# EAGLE design jlink_to_tag (EAGLE 6.5.0)
AUTHOR: Brad Campbell; REV: D; TITLE: JLink to Tag Connect x8

## Sheet 1 of 3
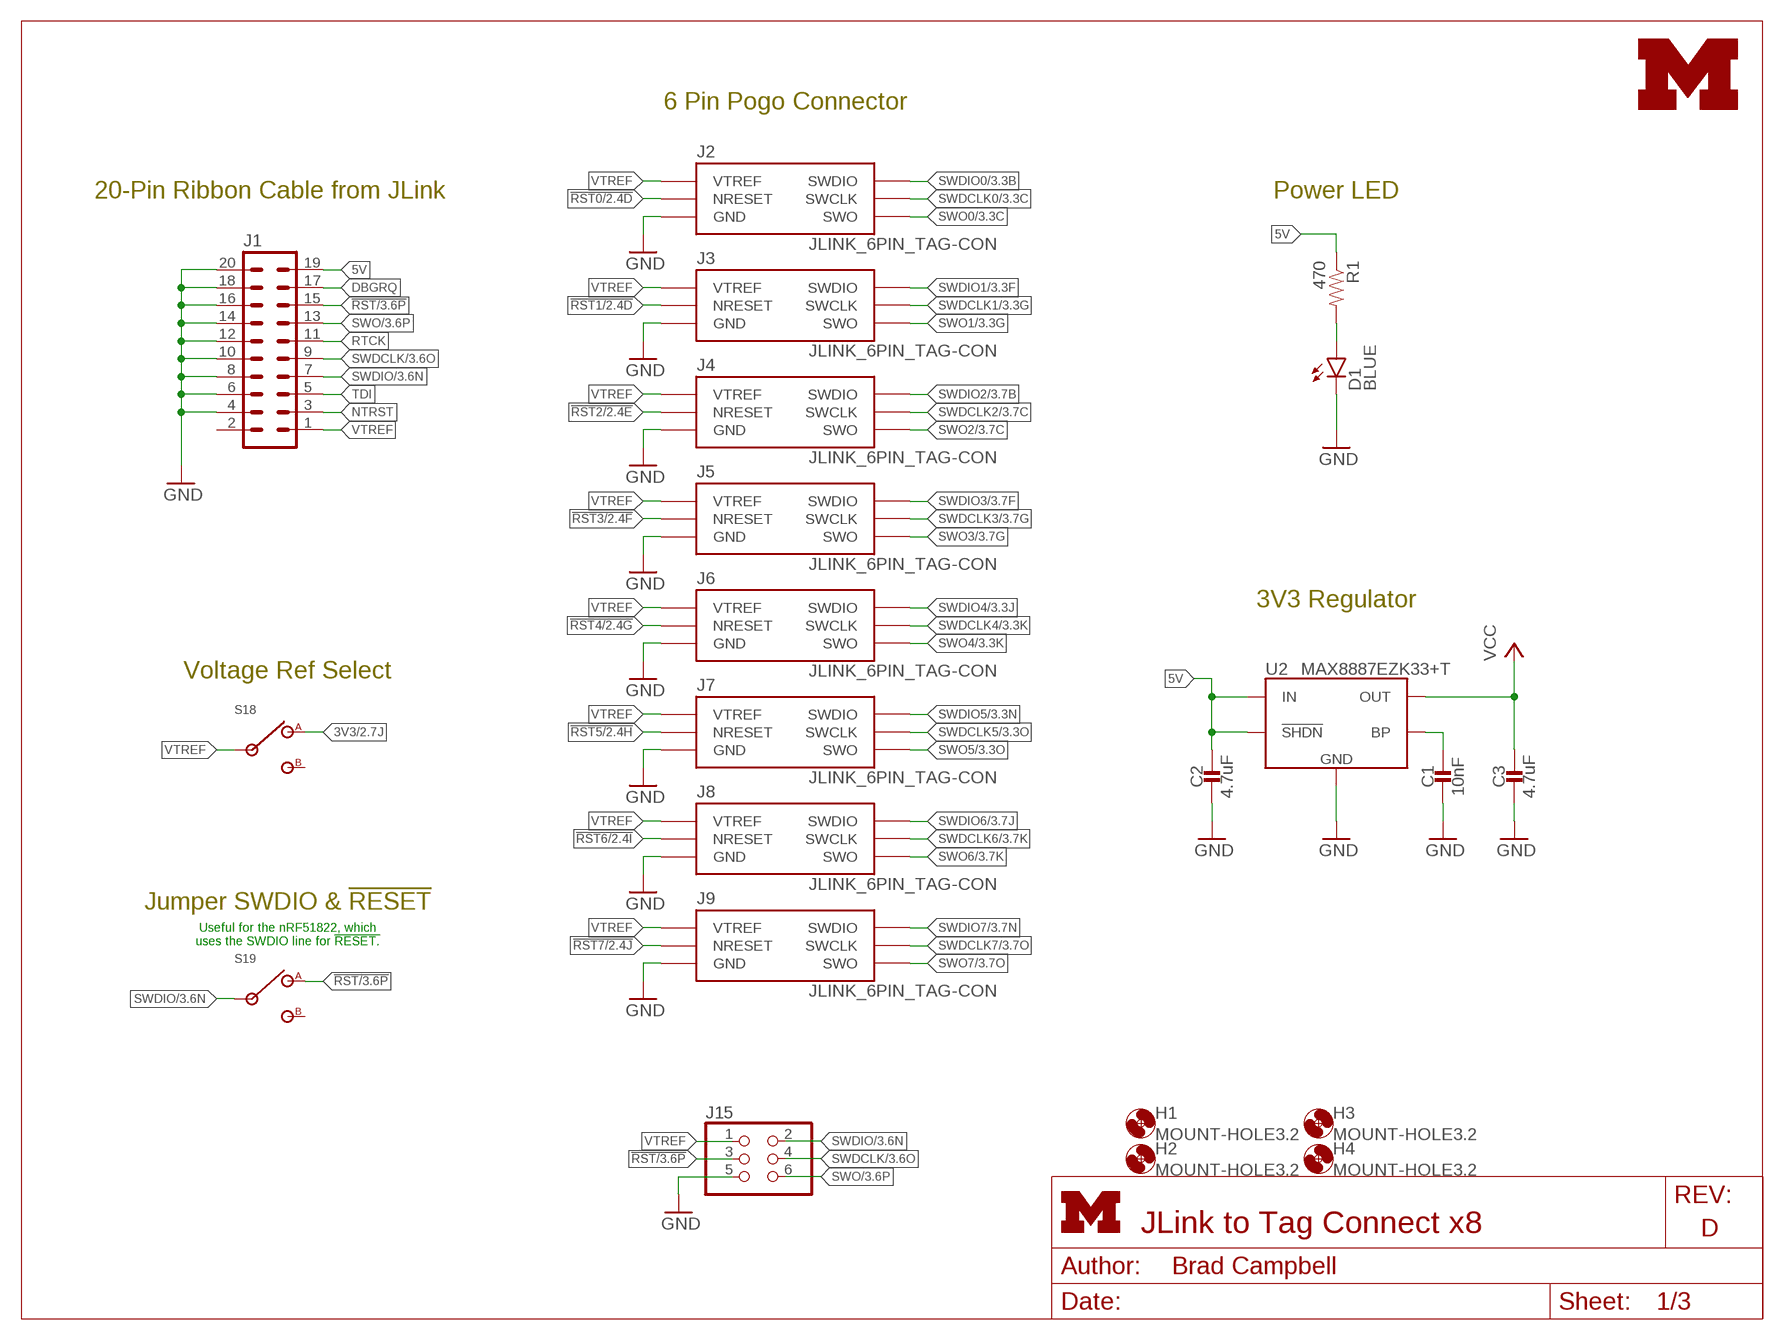
[diagram p0: schematic, sheet 1]
FRAME1 (LETTER_L): HEIGHT: 8.5in; WIDTH: 11in

### Parts
C1  10nF  CAPACITOR0603_CAP  [0603_CAP]
C2  4.7uF  CAPACITOR0603_CAP  [0603_CAP]
C3  4.7uF  CAPACITOR0603_CAP  [0603_CAP]
D1  BLUE  LED-BLUE0603  [LED-0603]
H1  MOUNT-HOLE3.2  [3,2]
H2  MOUNT-HOLE3.2  [3,2]
H3  MOUNT-HOLE3.2  [3,2]
H4  MOUNT-HOLE3.2  [3,2]
J1  ML20  [ML20]
J2  JLINK_6PIN_TAG-CON  [2X3_MALE_SHROUDED_0.100]
J3  JLINK_6PIN_TAG-CON  [2X3_MALE_SHROUDED_0.100]
J4  JLINK_6PIN_TAG-CON  [2X3_MALE_SHROUDED_0.100]
J5  JLINK_6PIN_TAG-CON  [2X3_MALE_SHROUDED_0.100]
J6  JLINK_6PIN_TAG-CON  [2X3_MALE_SHROUDED_0.100]
J7  JLINK_6PIN_TAG-CON  [2X3_MALE_SHROUDED_0.100]
J8  JLINK_6PIN_TAG-CON  [2X3_MALE_SHROUDED_0.100]
J9  JLINK_6PIN_TAG-CON  [2X3_MALE_SHROUDED_0.100]
J15  PINHD-2X3  [2X03]
LOGO1  UMICH_SOLID_SMALL+  [UMICH_SOLID_100MIL]
R1  470  RESISTOR0603-RES  [0603-RES]
S18  STS121PC04  [STS121PC04]
S19  STS121PC04  [STS121PC04]
U2  MAX8887EZK33+T  [SOT-23-5]

### Nets
3V3: C3.1 S18.1 U2.5(OUT) ; supply symbol labelled VCC ; also sheet 2,3
5V: C2.1 J1.19 R1.1 U2.1(IN) U2.3(!SHDN)
!RST: J1.15 J15.3 S19.1 ; also sheet 3
!RST0: J2.3(NRESET) ; also sheet 2,3
!RST1: J3.3(NRESET) ; also sheet 2,3
!RST2: J4.3(NRESET) ; also sheet 2,3
!RST3: J5.3(NRESET) ; also sheet 2,3
!RST4: J6.3(NRESET) ; also sheet 2,3
!RST5: J7.3(NRESET) ; also sheet 2,3
!RST6: J8.3(NRESET) ; also sheet 2,3
!RST7: J9.3(NRESET) ; also sheet 2,3
DBGRQ: J1.17
GND: C1.2 C2.2 C3.2 D1.C J1.4 J1.6 J1.8 J1.10 J1.12 J1.14 J1.16 J1.18 J1.20 J2.5(GND) J3.5(GND) J4.5(GND) J5.5(GND) J6.5(GND) J7.5(GND) J8.5(GND) J9.5(GND) J15.5 U2.2(GND) ; also sheet 2,3
N$1: C1.1 U2.4(BP)
N$3: D1.A R1.2
NTRST: J1.3
RTCK: J1.11
SWDCLK: J1.9 J15.4 ; also sheet 3
SWDCLK0: J2.4(SWCLK) ; also sheet 3
SWDCLK1: J3.4(SWCLK) ; also sheet 3
SWDCLK2: J4.4(SWCLK) ; also sheet 3
SWDCLK3: J5.4(SWCLK) ; also sheet 3
SWDCLK4: J6.4(SWCLK) ; also sheet 3
SWDCLK5: J7.4(SWCLK) ; also sheet 3
SWDCLK6: J8.4(SWCLK) ; also sheet 3
SWDCLK7: J9.4(SWCLK) ; also sheet 3
SWDIO: J1.7 J15.2 S19.2 ; also sheet 3
SWDIO0: J2.2(SWDIO) ; also sheet 3
SWDIO1: J3.2(SWDIO) ; also sheet 3
SWDIO2: J4.2(SWDIO) ; also sheet 3
SWDIO3: J5.2(SWDIO) ; also sheet 3
SWDIO4: J6.2(SWDIO) ; also sheet 3
SWDIO5: J7.2(SWDIO) ; also sheet 3
SWDIO6: J8.2(SWDIO) ; also sheet 3
SWDIO7: J9.2(SWDIO) ; also sheet 3
SWO: J1.13 J15.6 ; also sheet 3
SWO0: J2.6(SWO) ; also sheet 3
SWO1: J3.6(SWO) ; also sheet 3
SWO2: J4.6(SWO) ; also sheet 3
SWO3: J5.6(SWO) ; also sheet 3
SWO4: J6.6(SWO) ; also sheet 3
SWO5: J7.6(SWO) ; also sheet 3
SWO6: J8.6(SWO) ; also sheet 3
SWO7: J9.6(SWO) ; also sheet 3
TDI: J1.5
VTREF: J1.1 J2.1(VTREF) J3.1(VTREF) J4.1(VTREF) J5.1(VTREF) J6.1(VTREF) J7.1(VTREF) J8.1(VTREF) J9.1(VTREF) J15.1 S18.2
Unconnected: J1.2 S18.3 S19.3

### Notes on the sheet
- 6 Pin Pogo Connector
- 20-Pin Ribbon Cable from JLink | Power LED
- 3V3 Regulator
- Voltage Ref Select
- Jumper SWDIO & !RESET
- Useful for the nRF51822, which
  uses the SWDIO line for !RESET.

## Sheet 2 of 3
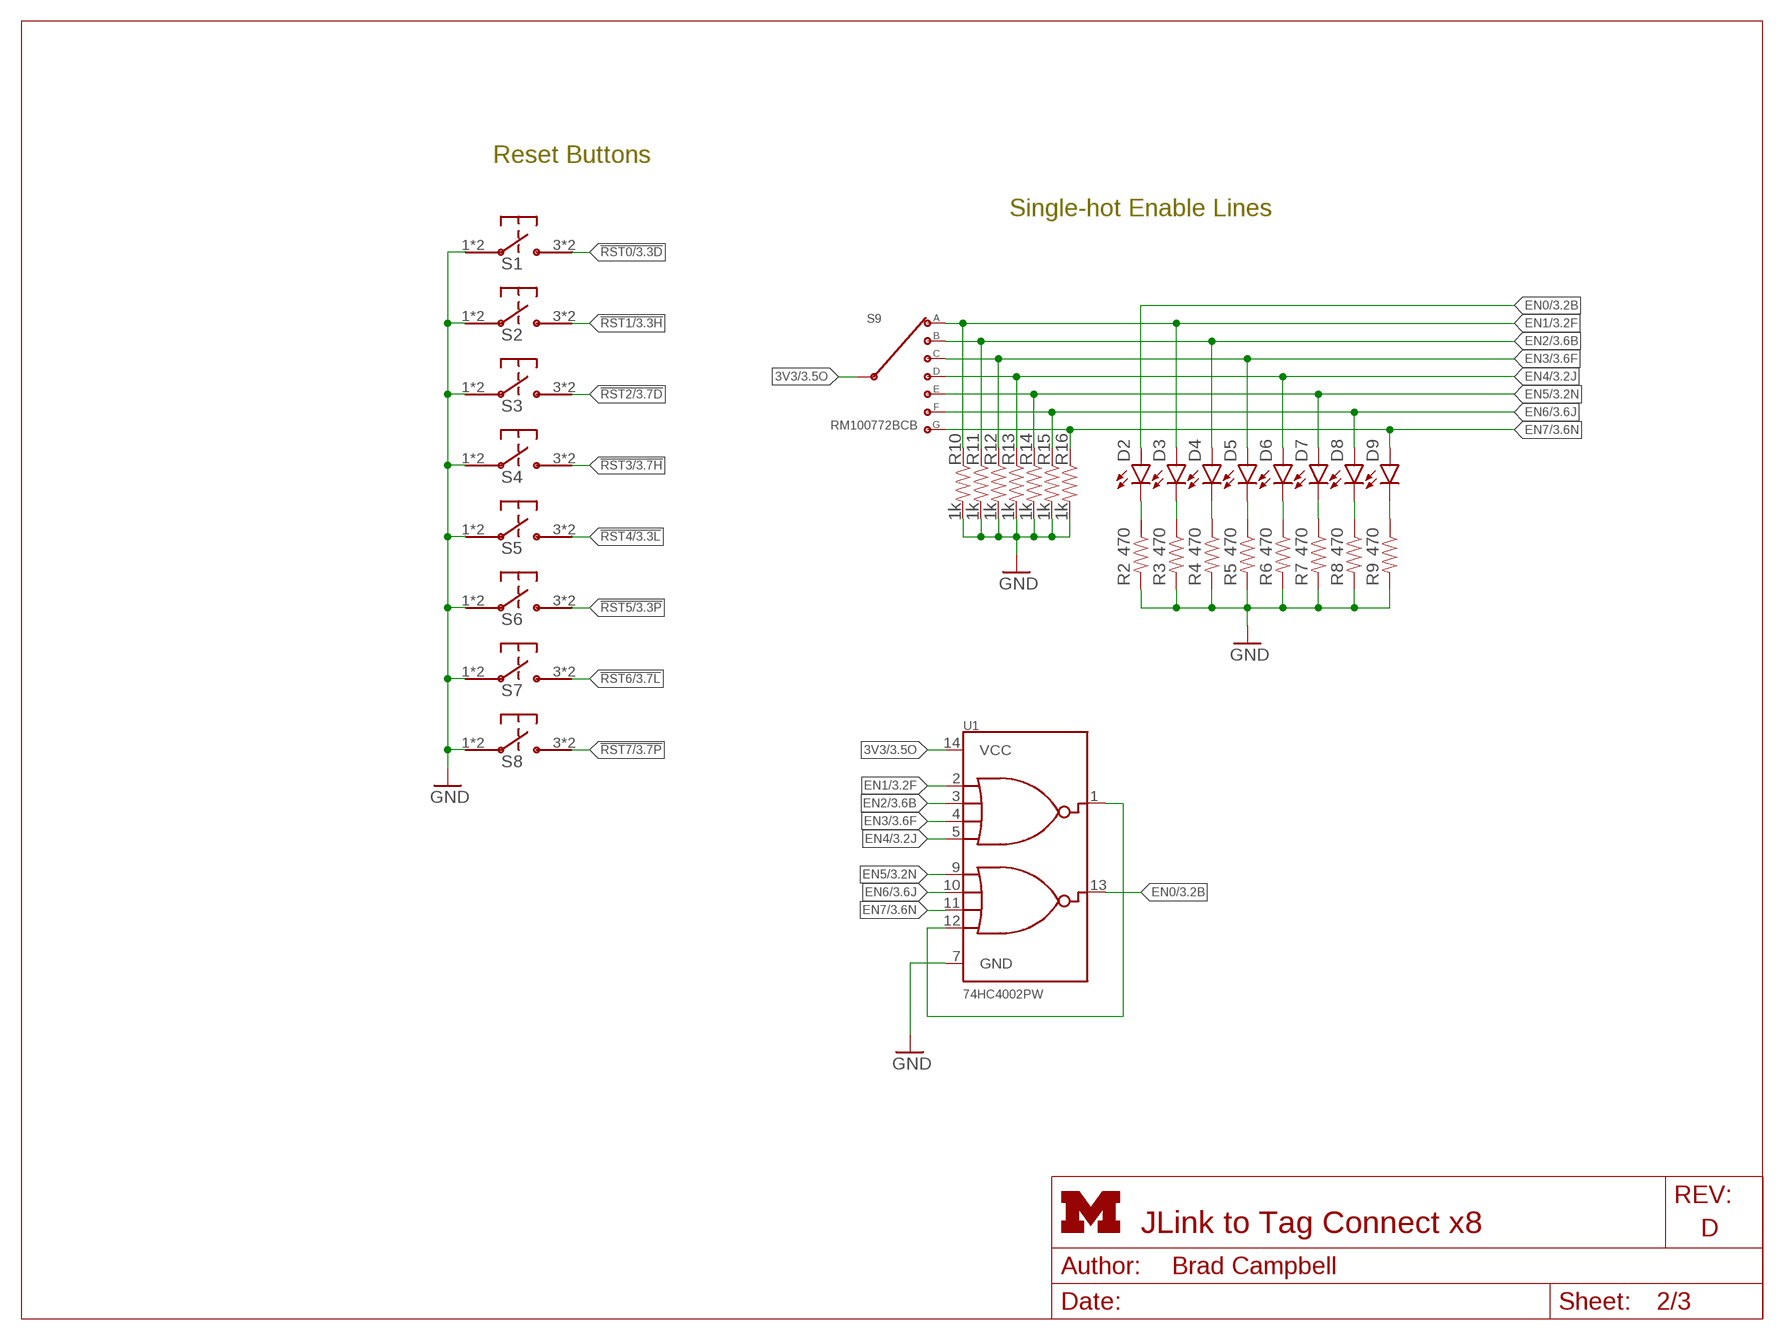
[diagram p1: schematic, sheet 2]
FRAME2 (LETTER_L): HEIGHT: 8.5in; WIDTH: 11in

### Parts
D2  BLUE  LED-BLUE0603  [LED-0603]
D3  BLUE  LED-BLUE0603  [LED-0603]
D4  BLUE  LED-BLUE0603  [LED-0603]
D5  BLUE  LED-BLUE0603  [LED-0603]
D6  BLUE  LED-BLUE0603  [LED-0603]
D7  BLUE  LED-BLUE0603  [LED-0603]
D8  BLUE  LED-BLUE0603  [LED-0603]
D9  BLUE  LED-BLUE0603  [LED-0603]
R2  470  RESISTOR0603-RES  [0603-RES]
R3  470  RESISTOR0603-RES  [0603-RES]
R4  470  RESISTOR0603-RES  [0603-RES]
R5  470  RESISTOR0603-RES  [0603-RES]
R6  470  RESISTOR0603-RES  [0603-RES]
R7  470  RESISTOR0603-RES  [0603-RES]
R8  470  RESISTOR0603-RES  [0603-RES]
R9  470  RESISTOR0603-RES  [0603-RES]
R10  1k  RESISTOR0603-RES  [0603-RES]
R11  1k  RESISTOR0603-RES  [0603-RES]
R12  1k  RESISTOR0603-RES  [0603-RES]
R13  1k  RESISTOR0603-RES  [0603-RES]
R14  1k  RESISTOR0603-RES  [0603-RES]
R15  1k  RESISTOR0603-RES  [0603-RES]
R16  1k  RESISTOR0603-RES  [0603-RES]
S1  PTS645SM43SMTR92  [PTS645]
S2  PTS645SM43SMTR92  [PTS645]
S3  PTS645SM43SMTR92  [PTS645]
S4  PTS645SM43SMTR92  [PTS645]
S5  PTS645SM43SMTR92  [PTS645]
S6  PTS645SM43SMTR92  [PTS645]
S7  PTS645SM43SMTR92  [PTS645]
S8  PTS645SM43SMTR92  [PTS645]
S9  RM100772BCB  [RM-SWITCH]
U1  74HC4002PW  [TSSOP-14/5MM]

### Nets
3V3: S9.C(INPUT) U1.14(VCC) ; also sheet 1,3
!RST0: S1.3 S1.4 ; also sheet 1,3
!RST1: S2.3 S2.4 ; also sheet 1,3
!RST2: S3.3 S3.4 ; also sheet 1,3
!RST3: S4.3 S4.4 ; also sheet 1,3
!RST4: S5.3 S5.4 ; also sheet 1,3
!RST5: S6.3 S6.4 ; also sheet 1,3
!RST6: S7.3 S7.4 ; also sheet 1,3
!RST7: S8.3 S8.4 ; also sheet 1,3
EN0: D2.A U1.13(BOUT) ; also sheet 3
EN1: D3.A R10.1 S9.1(A) U1.2(A1) ; also sheet 3
EN2: D4.A R11.1 S9.2(B) U1.3(A2) ; also sheet 3
EN3: D5.A R12.1 S9.3(C) U1.4(A3) ; also sheet 3
EN4: D6.A R13.1 S9.4(D) U1.5(A4) ; also sheet 3
EN5: D7.A R14.1 S9.5(E) U1.9(B1) ; also sheet 3
EN6: D8.A R15.1 S9.6(F) U1.10(B2) ; also sheet 3
EN7: D9.A R16.1 S9.7(G) U1.11(B3) ; also sheet 3
GND: R2.2 R3.2 R4.2 R5.2 R6.2 R7.2 R8.2 R9.2 R10.2 R11.2 R12.2 R13.2 R14.2 R15.2 R16.2 S1.1 S1.2 S2.1 S2.2 S3.1 S3.2 S4.1 S4.2 S5.1 S5.2 S6.1 S6.2 S7.1 S7.2 S8.1 S8.2 U1.7(GND) ; also sheet 1,3
N$2: D2.C R2.1
N$5: D3.C R3.1
N$6: D4.C R4.1
N$7: D5.C R5.1
N$8: D6.C R6.1
N$9: D7.C R7.1
N$10: D8.C R8.1
N$11: D9.C R9.1
N$15: U1.1(AOUT) U1.12(B4)

### Notes on the sheet
- Reset Buttons
- Single-hot Enable Lines

## Sheet 3 of 3
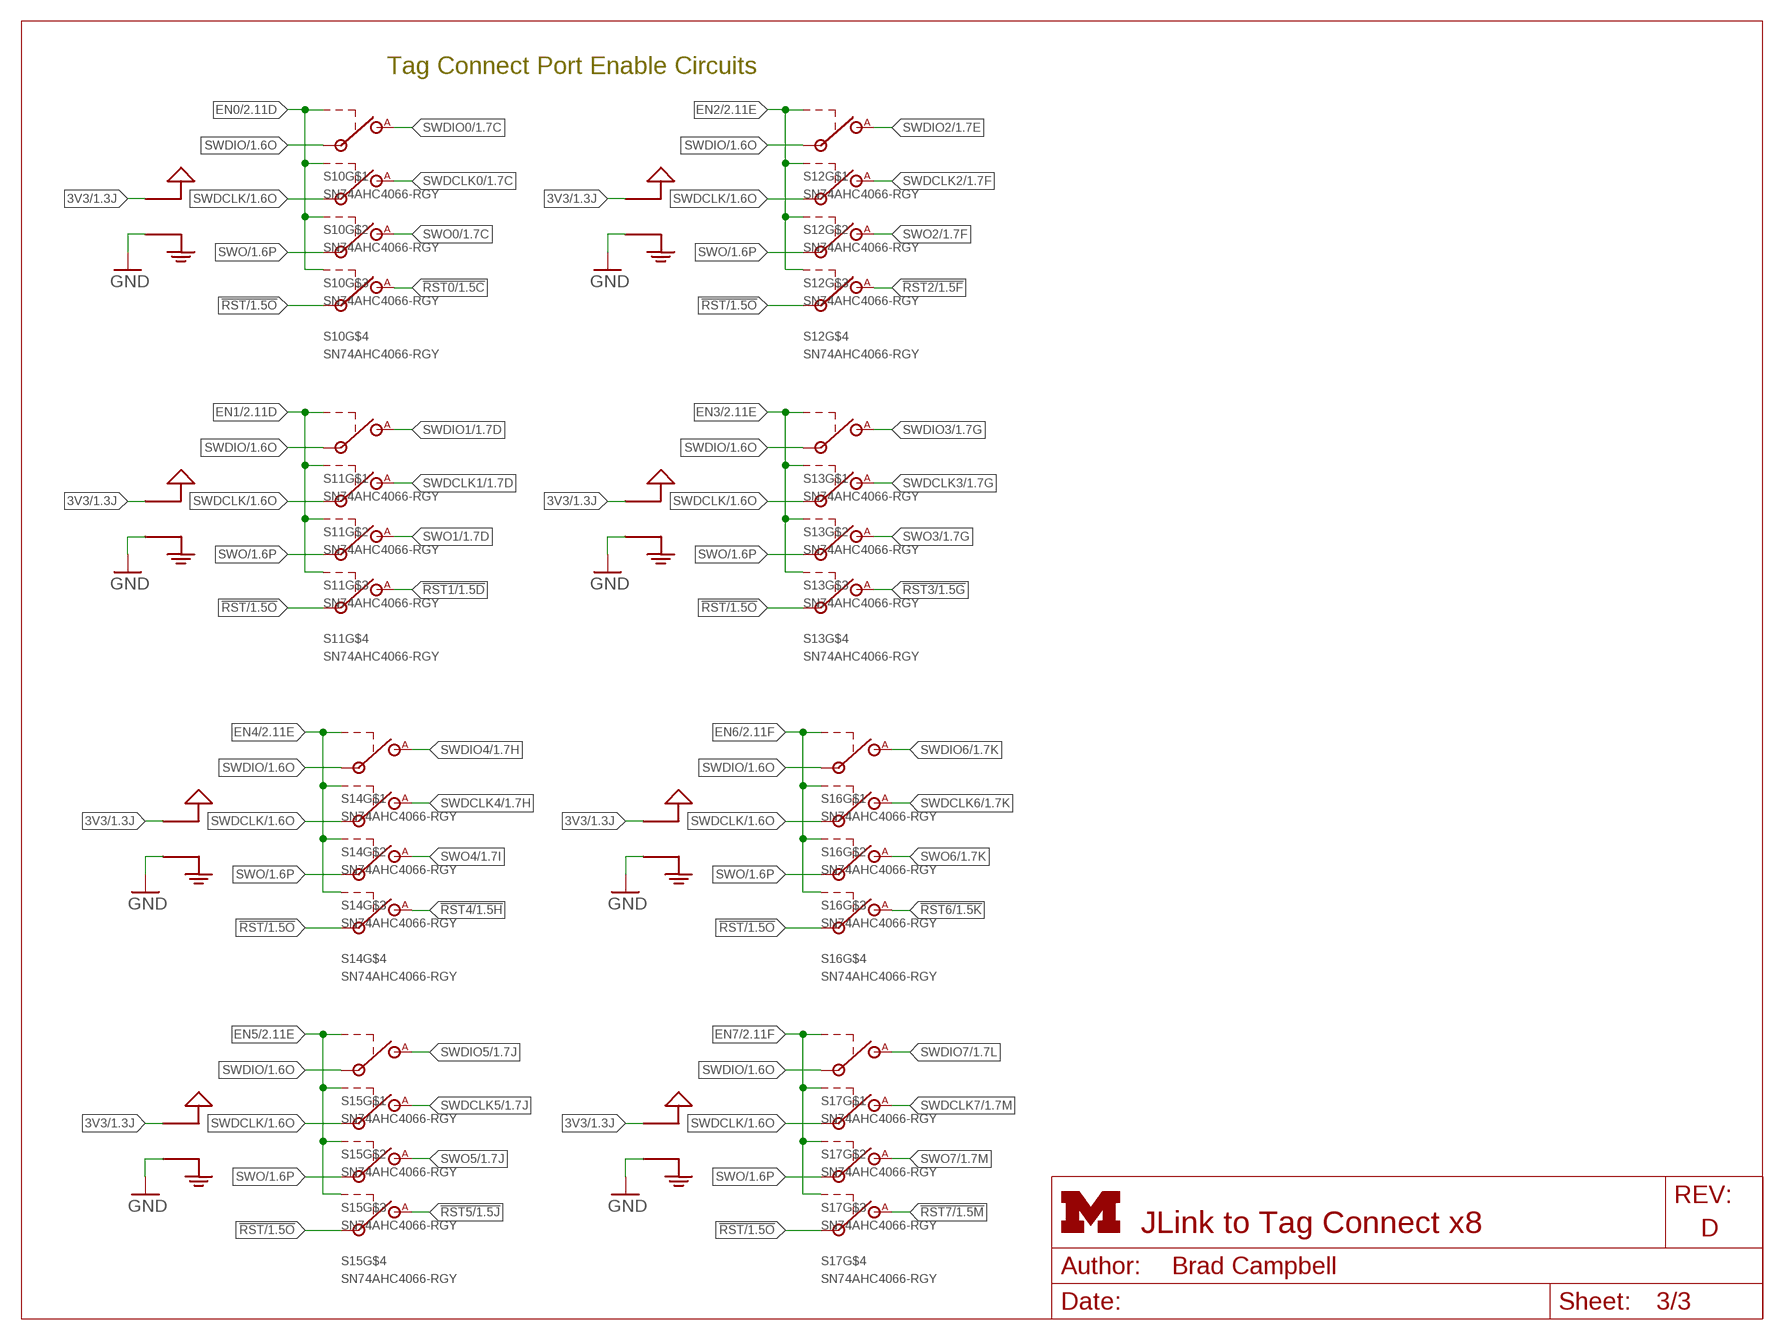
[diagram p2: schematic, sheet 3]
FRAME3 (LETTER_L): HEIGHT: 8.5in; WIDTH: 11in

### Parts
S10  SN74AHC4066-RGY  [S-PVQFN-N14-3.5MM]
S11  SN74AHC4066-RGY  [S-PVQFN-N14-3.5MM]
S12  SN74AHC4066-RGY  [S-PVQFN-N14-3.5MM]
S13  SN74AHC4066-RGY  [S-PVQFN-N14-3.5MM]
S14  SN74AHC4066-RGY  [S-PVQFN-N14-3.5MM]
S15  SN74AHC4066-RGY  [S-PVQFN-N14-3.5MM]
S16  SN74AHC4066-RGY  [S-PVQFN-N14-3.5MM]
S17  SN74AHC4066-RGY  [S-PVQFN-N14-3.5MM]

### Nets
3V3: S10.14(VCC) S11.14(VCC) S12.14(VCC) S13.14(VCC) S14.14(VCC) S15.14(VCC) S16.14(VCC) S17.14(VCC) ; also sheet 1,2
!RST: S10.11(IN) S11.11(IN) S12.11(IN) S13.11(IN) S14.11(IN) S15.11(IN) S16.11(IN) S17.11(IN) ; also sheet 1
!RST0: S10.10(A) ; also sheet 1,2
!RST1: S11.10(A) ; also sheet 1,2
!RST2: S12.10(A) ; also sheet 1,2
!RST3: S13.10(A) ; also sheet 1,2
!RST4: S14.10(A) ; also sheet 1,2
!RST5: S15.10(A) ; also sheet 1,2
!RST6: S16.10(A) ; also sheet 1,2
!RST7: S17.10(A) ; also sheet 1,2
EN0: S10.5(CTRL) S10.6(CTRL) S10.12(CTRL) S10.13(CTRL) ; also sheet 2
EN1: S11.5(CTRL) S11.6(CTRL) S11.12(CTRL) S11.13(CTRL) ; also sheet 2
EN2: S12.5(CTRL) S12.6(CTRL) S12.12(CTRL) S12.13(CTRL) ; also sheet 2
EN3: S13.5(CTRL) S13.6(CTRL) S13.12(CTRL) S13.13(CTRL) ; also sheet 2
EN4: S14.5(CTRL) S14.6(CTRL) S14.12(CTRL) S14.13(CTRL) ; also sheet 2
EN5: S15.5(CTRL) S15.6(CTRL) S15.12(CTRL) S15.13(CTRL) ; also sheet 2
EN6: S16.5(CTRL) S16.6(CTRL) S16.12(CTRL) S16.13(CTRL) ; also sheet 2
EN7: S17.5(CTRL) S17.6(CTRL) S17.12(CTRL) S17.13(CTRL) ; also sheet 2
GND: S10.7(GND) S11.7(GND) S12.7(GND) S13.7(GND) S14.7(GND) S15.7(GND) S16.7(GND) S17.7(GND) ; also sheet 1,2
SWDCLK: S10.4(IN) S11.4(IN) S12.4(IN) S13.4(IN) S14.4(IN) S15.4(IN) S16.4(IN) S17.4(IN) ; also sheet 1
SWDCLK0: S10.3(A) ; also sheet 1
SWDCLK1: S11.3(A) ; also sheet 1
SWDCLK2: S12.3(A) ; also sheet 1
SWDCLK3: S13.3(A) ; also sheet 1
SWDCLK4: S14.3(A) ; also sheet 1
SWDCLK5: S15.3(A) ; also sheet 1
SWDCLK6: S16.3(A) ; also sheet 1
SWDCLK7: S17.3(A) ; also sheet 1
SWDIO: S10.1(IN) S11.1(IN) S12.1(IN) S13.1(IN) S14.1(IN) S15.1(IN) S16.1(IN) S17.1(IN) ; also sheet 1
SWDIO0: S10.2(A) ; also sheet 1
SWDIO1: S11.2(A) ; also sheet 1
SWDIO2: S12.2(A) ; also sheet 1
SWDIO3: S13.2(A) ; also sheet 1
SWDIO4: S14.2(A) ; also sheet 1
SWDIO5: S15.2(A) ; also sheet 1
SWDIO6: S16.2(A) ; also sheet 1
SWDIO7: S17.2(A) ; also sheet 1
SWO: S10.8(IN) S11.8(IN) S12.8(IN) S13.8(IN) S14.8(IN) S15.8(IN) S16.8(IN) S17.8(IN) ; also sheet 1
SWO0: S10.9(A) ; also sheet 1
SWO1: S11.9(A) ; also sheet 1
SWO2: S12.9(A) ; also sheet 1
SWO3: S13.9(A) ; also sheet 1
SWO4: S14.9(A) ; also sheet 1
SWO5: S15.9(A) ; also sheet 1
SWO6: S16.9(A) ; also sheet 1
SWO7: S17.9(A) ; also sheet 1

### Notes on the sheet
- Tag Connect Port Enable Circuits

## Library data of the parts
C1 = passives:CAPACITOR: 0402 Capacitor; DIGIKEY: 490-1512-1-ND
C2 C3 = passives:CAPACITOR: 0402 Capacitor; DIGIKEY: 490-3297-1-ND
D1-D9 = SparkFun-LED:LED-BLUE: Blue LEDs for production use Various blue LEDs stocked by SparkFun production 0603 - DIO-08575 Rebel - DIO-09553 1206 - DIO-09911; PROD_ID: DIO-08575
H1-H4 = holes:MOUNT-HOLE: MOUNTING HOLE with drill center marker
J1 = con-ml:ML20: HARTING; DIGIKEY: S9172-ND; OC_FARNELL: unknown; OC_NEWARK: unknown
J2-J9 = headers:JLINK_6PIN_TAG-CON: This is a 6-pin Tag Connect header with the J-Link.; DIGIKEY: 3M15451-ND
J15 = pinhead:PINHD-2X3: PIN HEADER
LOGO1 = logos:UMICH_SOLID
R1-R16 = SparkFun-Passives:RESISTOR: Resistor Basic schematic elements and footprints for 0603, 1206, and PTH resistors.
S1-S8 = switches:PTS645SM43SMTR92: Tactile Switch SPST-NO Top Actuated Surface Mount; DIGIKEY: CKN9112CT-ND
S9 = switches:RM100772BCB: Rotary Switch 8 Position SP7T 500mA (DC) 24VDC Through Hole
S10-S17 = switches:SN74AHC4066; DIGIKEY: 296-15258-1-ND
S18 S19 = switches:STS121PC04: Slide Switch SPDT Through Hole; DIGIKEY: 450-1609-ND
U1 = chips:74HC4002PW: NOR Gate IC 2 Channel 14-TSSOP; DIGIKEY: 568-8879-1-ND
U2 = chips:MAX8887: IC REG LDO 3.3V 0.3A TSOT23-5; DIGIKEY: MAX8887EZK33+TCT-ND

## Board
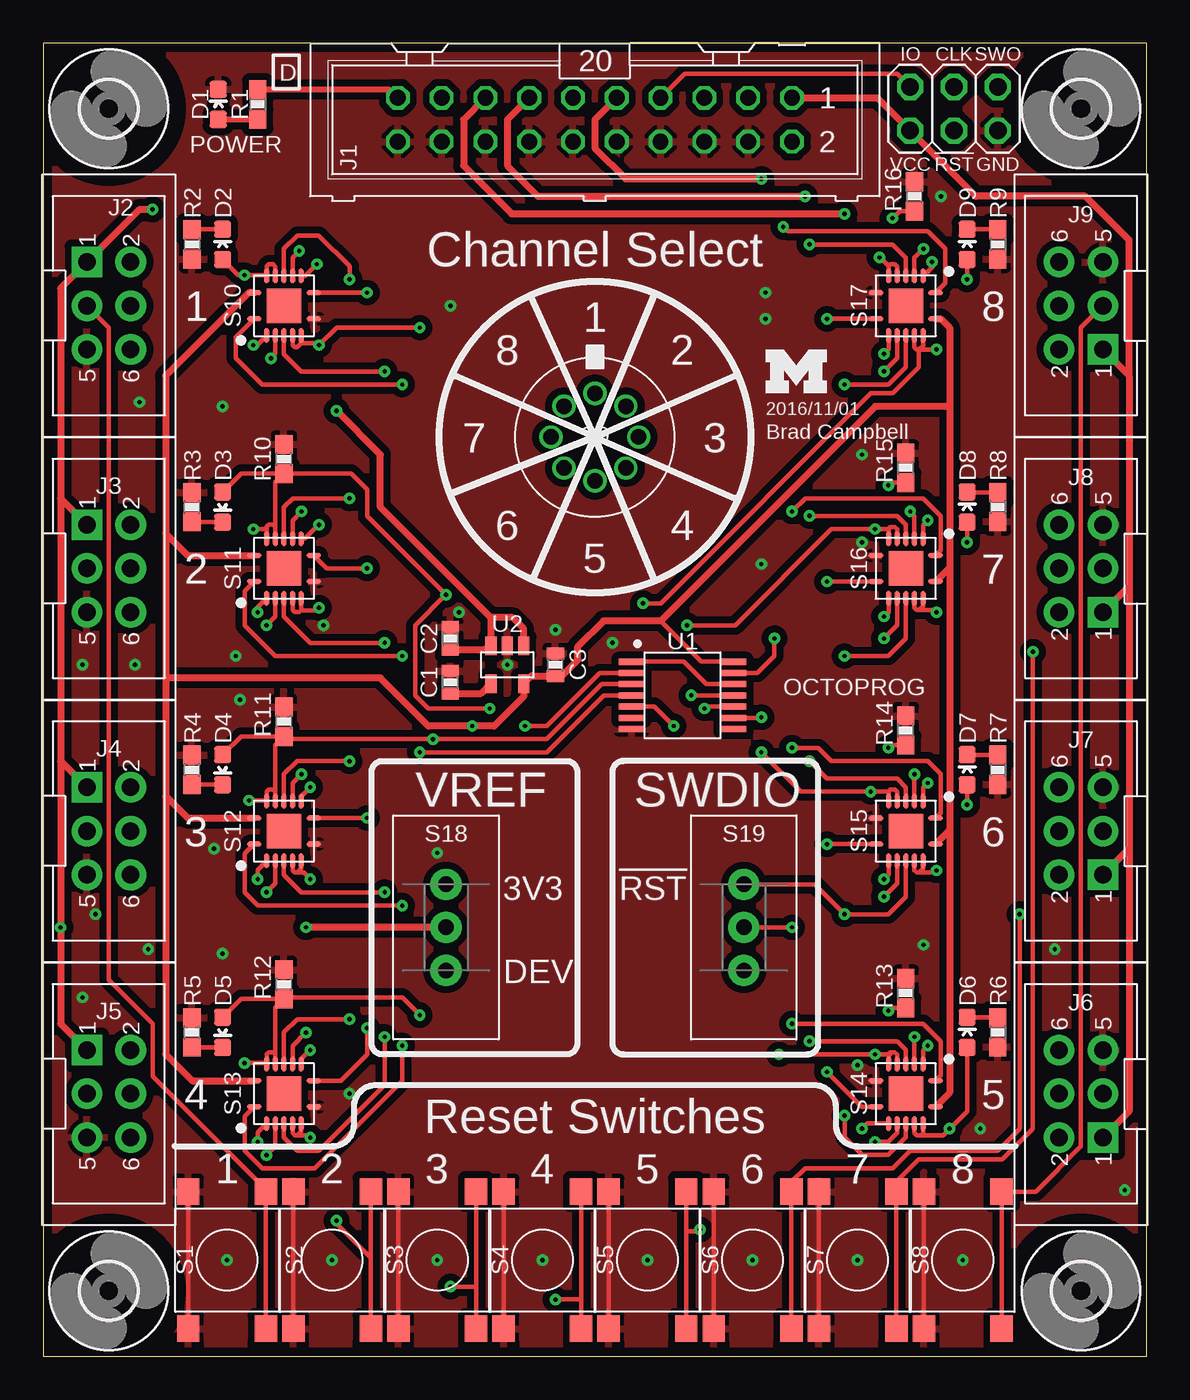
[diagram p3: board, top side]
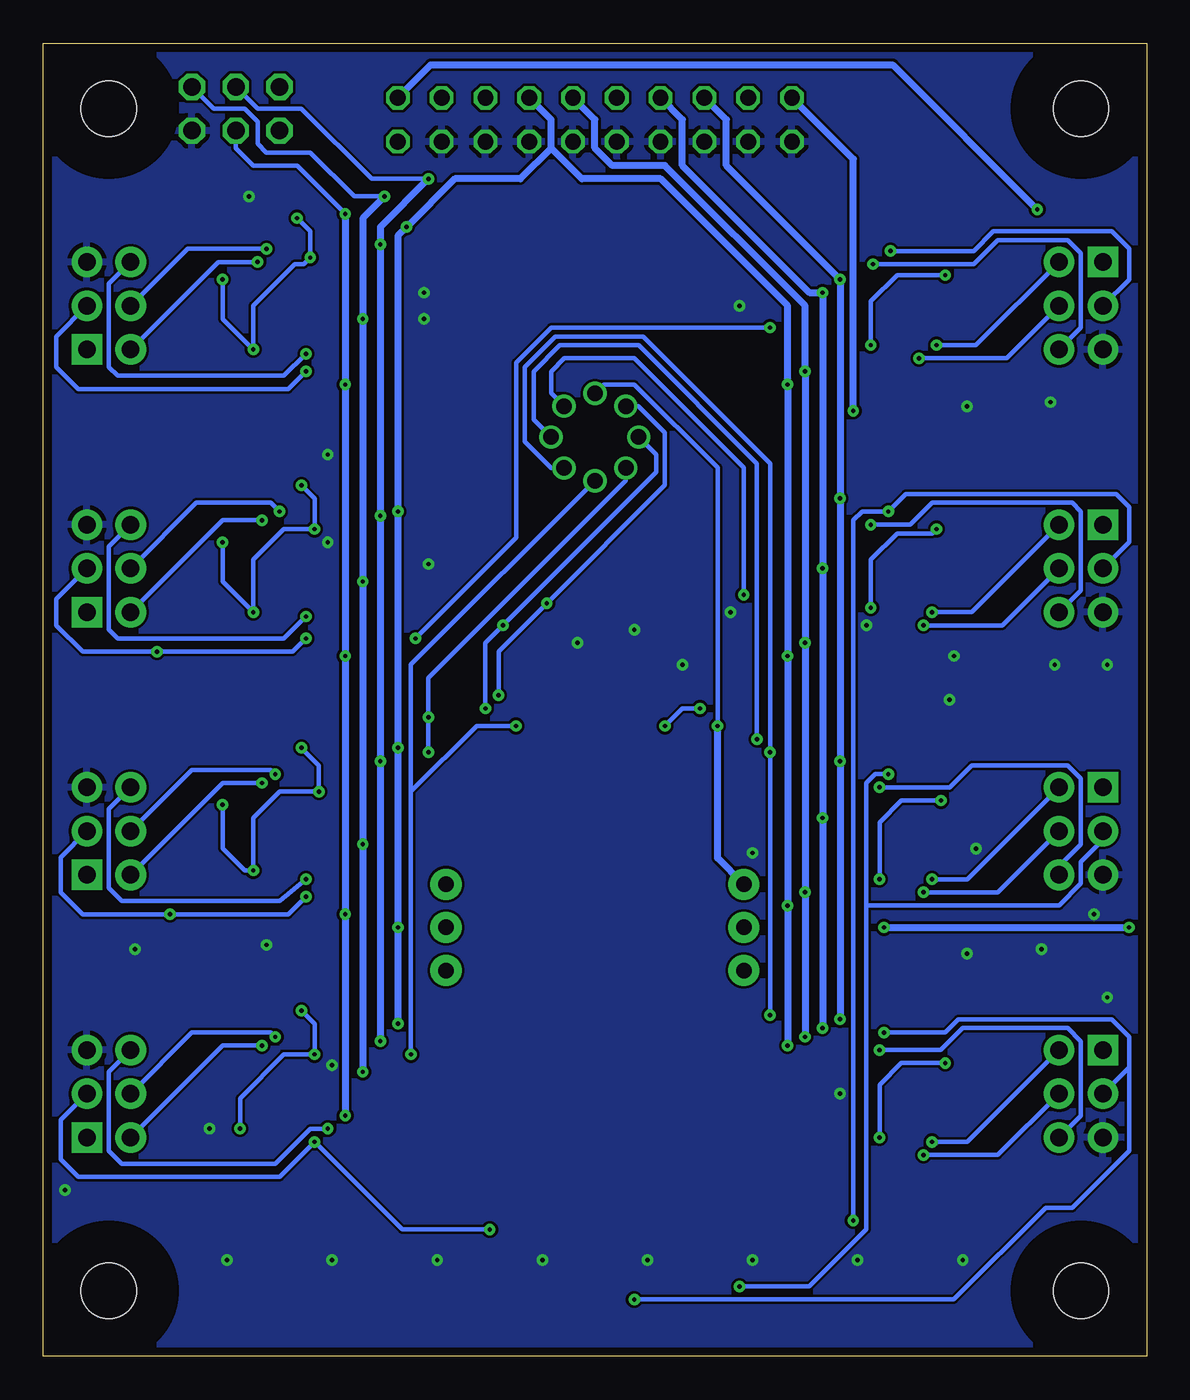
[diagram p4: board, bottom side, seen from below]

Size 64.01 x 76.2 mm. Coordinates in mm from the lower left corner, seen from the top.
Outline: 0,76.2 0,0 64.01,0 64.01,76.2 0,76.2
Copper layers (1*16): Top 0.0178mm / dielectric 59mil / Bottom 0.0178mm
Design rules "sunstone-2lyr_v1.0.0.3 *": minimum track width 6mil, minimum drill 8mil, track to track 6mil, track to pad 6mil, pad to pad 6mil, via to via 6mil, smd to smd 6mil, copper to edge 20mil, drill to drill 16mil, minimum pad ring 8mil, minimum via ring 8mil, stop-mask expansion 3mil, vias tented up to drill 50mil, thermal gap 10mil

### Footprints (pad centres in the part's own frame; a part is rotated, then mirrored left to right if it is on the bottom)
0603_CAP = smd 0.7 x 1: 1 -0.65,0; 2 0.65,0
LED-0603 = smd 1 x 1: A 0,-0.877; C 0,0.877
3,2 = hole 3.2: 0,0
ML20 = drill 0.914 octagon: 1 -11.43,-1.27; 2 -11.43,1.27; 3 -8.89,-1.27; 4 -8.89,1.27; 5 -6.35,-1.27; 6 -6.35,1.27; 7 -3.81,-1.27; 8 -3.81,1.27; 9 -1.27,-1.27; 10 -1.27,1.27; 11 1.27,-1.27; 12 1.27,1.27; 13 3.81,-1.27; 14 3.81,1.27; 15 6.35,-1.27; 16 6.35,1.27; 17 8.89,-1.27; 18 8.89,1.27; 19 11.43,-1.27; 20 11.43,1.27
2X3_MALE_SHROUDED_0.100 = drill 1.016 pad 1.778 square: 1 -2.54,-1.27 | drill 1.016 pad 1.778: 2 -2.54,1.27; 3 0,-1.27; 4 0,1.27; 5 2.54,-1.27; 6 2.54,1.27
2X03 = drill 1.016 octagon: 1 -2.54,-1.27; 2 -2.54,1.27; 3 0,-1.27; 4 0,1.27; 5 2.54,-1.27; 6 2.54,1.27
0603-RES = smd 1.1 x 1: 1 -0.85,0; 2 0.85,0
PTS645 = smd 1.55 x 1.3: 1 -3.975,2.25; 2 3.975,2.25; 3 3.975,-2.25; 4 -3.975,-2.25
RM-SWITCH = drill 0.9: 1 1.796,1.796; 2 2.54,0; 3 1.796,-1.796; 4 0,-2.54; 5 -1.796,-1.796; 6 -2.54,0; 7 -1.796,1.796; C 0,2.54
S-PVQFN-N14-3.5MM = smd 0.85 x 0.28: 1 -1.725,-0.75; 7 1.725,-0.75; 8 1.725,0.75; 14 -1.725,0.75 | smd 0.28 x 0.85: 2 -1,-1.725; 3 -0.5,-1.725; 4 0,-1.725; 5 0.5,-1.725; 6 1,-1.725; 9 1,1.725; 10 0.5,1.725; 11 0,1.725; 12 -0.5,1.725; 13 -1,1.725 | smd 2 x 2: PAD 0,0
STS121PC04 = drill 0.9 pad 1.8: 1 -2.5,0; 2 0,0; 3 2.5,0
TSSOP-14/5MM = smd 1.5 x 0.35: 1 -2.95,1.95; 2 -2.95,1.3; 3 -2.95,0.65; 4 -2.95,0; 5 -2.95,-0.65; 6 -2.95,-1.3; 7 -2.95,-1.95; 8 2.95,-1.95; 9 2.95,-1.3; 10 2.95,-0.65; 11 2.95,0; 12 2.95,0.65; 13 2.95,1.3; 14 2.95,1.95
SOT-23-5 = smd 0.65 x 1.06: 1 -0.95,-1.1; 2 0,-1.1; 3 0.95,-1.1; 4 0.95,1.1; 5 -0.95,1.1

### Placement (x,y rotation side)
C1  23.62,39.12 90 top
C2  23.62,41.66 90 top
C3  29.72,40.13 90 top
D1  10.16,72.64 0 top
D2  10.41,64.52 0 top
D3  10.41,49.28 180 top
D4  10.41,34.04 180 top
D5  10.41,18.8 180 top
D6  53.59,18.8 0 top
D7  53.59,34.04 0 top
D8  53.59,49.28 0 top
D9  53.59,64.52 0 top
H1  3.81,72.39 0 top
H2  60.2,72.39 0 top
H3  3.81,3.81 0 top
H4  60.2,3.81 0 top
J1  32,71.75 180 top
J2  3.81,60.96 270 top
J3  3.81,45.72 270 top
J4  3.81,30.48 270 top
J5  3.81,15.24 270 top
J6  60.2,15.24 90 top
J7  60.2,30.48 90 top
J8  60.2,45.72 90 top
J9  60.2,60.96 90 top
J15  52.83,72.39 0 top
LOGO1  41.91,55.88 0 top
R1  12.45,72.64 270 top
R2  8.64,64.52 270 top
R3  8.64,49.28 90 top
R4  8.64,34.04 90 top
R5  8.64,18.8 90 top
R6  55.37,18.8 270 top
R7  55.37,34.04 270 top
R8  55.37,49.28 270 top
R9  55.37,64.52 270 top
R10  13.97,52.07 90 top
R11  13.97,36.83 90 top
R12  13.97,21.59 90 top
R13  50.04,21.08 90 top
R14  50.04,36.32 90 top
R15  50.04,51.56 90 top
R16  50.55,67.31 90 top
S1  10.67,5.59 90 top
S2  16.76,5.59 90 top
S3  22.86,5.59 90 top
S4  28.96,5.59 90 top
S5  35.05,5.59 90 top
S6  41.15,5.59 90 top
S7  47.24,5.59 90 top
S8  53.34,5.59 90 top
S9  32,53.34 0 top
S10  13.97,60.96 0 top
S11  13.97,45.72 0 top
S12  13.97,30.48 0 top
S13  13.97,15.24 0 top
S14  50.04,15.24 180 top
S15  50.04,30.48 180 top
S16  50.04,45.72 180 top
S17  50.04,60.96 180 top
S18  23.37,24.89 270 top
S19  40.64,24.89 270 top
U1  37.08,38.35 0 top
U2  26.92,40.13 180 top

### Tracks (layer width: path | path; a pad name or v marks a point on that pad's centre or on a via)
3V3  (via drill 0.25)
  Top 0.254: U1.14 38.18,40.3 35.81,42.67
  Top 0.406: S10.14 11.93,61.71 7.11,56.9 7.11,47.75 | 7.11,47.75 8.39,46.47 S11.14 | 7.11,47.75 7.11,39.37 | 7.11,39.37 7.11,32.51 | 7.11,32.51 8.39,31.23 S12.14 | 7.11,32.51 7.11,17.53 8.65,15.99 S13.14 | S17.14 52.06,60.21 52.58,59.69 52.58,55.12 | 52.58,55.12 52.58,45.78 | 52.58,45.78 S16.14 | 52.58,45.78 52.58,30.55 | 52.58,30.55 S15.14 | 52.58,30.55 52.58,15.3 S14.14 | 52.58,55.12 48.26,55.12 35.81,42.67 32.51,42.67 30.99,41.15 30.99,40.39 30.08,39.48 C3.1 28.32,39.48 U2.5 27.87,38.29 26.16,36.58 v24.89,36.58 22.35,36.58 19.56,39.37 7.11,39.37
  Bottom 0.254: S9.C 31.5,56.39 29.72,56.39 24.89,51.56 v24.89,36.58
  Bottom 0.406: S18.1 24.89,28.92 v24.89,36.58
5V  (via drill 0.25)
  Top 0.356: J1.19 20.11,73.49 R1.1
  Top 0.406: 25.97,42.86 19.56,49.28 19.56,52.32 v17.02,54.86 | 25.97,42.86 U2.3 25.49,41.01 C2.1 | U2.1 27.87,42.23 27.24,42.86 25.97,42.86
  Bottom 0.406: v17.02,54.86 17.02,69.47 J1.19
!RST  (via drill 0.25)
  Top 0.254: S10.11 13.97,64.26 14.73,65.02 16,65.02 17.78,63.25 v17.78,62.48 | S11.11 13.97,49.28 14.48,49.78 v17.78,49.78 | S12.11 13.97,33.78 14.73,34.54 v17.78,34.54 | S13.11 13.97,18.8 14.73,19.56 v17.78,19.56 | S17.11 50.04,57.4 49.02,56.39 v46.48,56.39 | S16.11 50.04,41.66 49.02,40.64 v46.48,40.64 | S15.11 50.04,26.67 49.02,25.65 v46.48,25.65 44.74,27.39 S19.1 | v46.48,13.97 46.48,12.7 47.5,11.68 49.02,11.68 50.04,12.7 S14.11
  Top 0.406: J1.15 24.38,71.75 24.38,69.09 27.18,66.29 v46.48,66.29
  Bottom 0.254: J15.3 52.83,70.1 51.82,69.09 49.28,69.09 v46.48,66.29
  Bottom 0.406: v17.78,19.56 v17.78,34.54 v17.78,49.78 v17.78,62.48 24.38,69.09 24.38,71.75 J1.15 | v46.48,66.29 v46.48,56.39 v46.48,40.64 v46.48,25.65 v46.48,13.97
!RST0  (via drill 0.25)
  Top 0.254: S10.10 14.47,63.75 v14.86,64.14 | S1.4 S1.3 12.92,9.69 6.35,16.26 6.35,19.3 3.81,21.84 3.81,59.69 J2.3
  Bottom 0.254: v14.86,64.14 10.03,64.14 8.89,65.28 2.03,65.28 1.02,64.26 1.02,62.48 J2.3
!RST1  (via drill 0.25)
  Top 0.254: S11.10 14.47,48.51 v14.99,49.02 | S2.4 19.01,5.71 | 19.01,5.71 S2.3 | 19.01,5.71 17.02,7.71 v17.02,7.87
  Bottom 0.254: J3.3 1.02,47.24 1.02,49.28 1.78,50.04 13.97,50.04 v14.99,49.02 16.51,49.02 17.02,48.51 v17.02,7.87
!RST2  (via drill 0.25)
  Top 0.254: S12.10 14.47,33.27 v14.99,33.78 | S3.3 25.11,4.05 | 25.11,4.05 S3.4 | 25.11,4.05 23.64,4.05 v23.62,4.06
  Bottom 0.254: v23.62,4.06 19.56,4.06 16.26,7.37 16.26,26.16 | 16.26,26.16 16.26,33.27 15.75,33.78 v14.99,33.78 | 16.26,26.16 5.08,26.16 3.81,27.43 3.81,28.7 2.54,29.97 J4.3
!RST3  (via drill 0.25)
  Top 0.254: S13.10 14.47,18.03 v15.24,18.8 | S4.3 31.21,3.3 | 31.21,3.3 S4.4 | v29.72,3.3 31.21,3.3
  Bottom 0.254: v15.24,18.8 11.68,18.8 10.92,19.56 2.03,19.56 1.02,18.54 1.02,16.76 | 1.02,16.76 J5.3 | 1.02,16.76 1.02,11.94 4.32,8.64 5.84,8.64 11.18,3.3 v29.72,3.3
!RST4  (via drill 0.25)
  Top 0.254: S5.3 37.3,7.25 | 37.3,7.25 S5.4 | S14.10 49.54,12.96 49.02,12.45 v48.26,12.45 | 37.3,7.25 37.98,7.25 v38.1,7.37
  Bottom 0.254: J6.3 62.99,13.72 62.99,11.43 61.98,10.41 50.29,10.41 v48.26,12.45 43.18,7.37 v38.1,7.37
!RST5  (via drill 0.25)
  Top 0.254: S6.4 S6.3 43.4,10.12 44.2,10.92 49.28,10.92 50.29,11.94 55.37,11.94 56.64,13.21 v56.64,25.65 | S15.10 49.54,27.44 v48.77,26.67
  Bottom 0.254: v48.77,26.67 49.78,25.65 v56.64,25.65 61.72,25.65 62.99,26.92 62.99,28.96 J7.3
!RST6  (via drill 0.25)
  Top 0.254: S7.4 S7.3 49.49,10.12 50.8,11.43 55.63,11.43 57.4,13.21 v57.4,40.89 | S16.10 49.54,42.43 v48.77,41.66
  Bottom 0.254: v48.77,41.66 49.53,40.89 v57.4,40.89 61.72,40.89 63.25,42.42 63.25,43.94 J8.3
!RST7  (via drill 0.25)
  Top 0.254: S8.4 S8.3 57.57,9.56 60.2,12.19 60.2,59.69 J9.3 | S17.10 49.54,57.92 v48.77,57.15
  Bottom 0.254: J9.3 63.25,59.18 63.25,57.4 61.98,56.13 51.31,56.13 51.05,56.13 49.78,56.13 v48.77,57.15
EN0  (via drill 0.25)
  Top 0.254: S10.12 13.47,63.24 13.34,63.37 13.08,63.37 12.97,63.26 S10.13 12.92,62.74 v11.68,62.74 11.31,62.74 D2.A | S10.5 14.47,58.68 14.61,58.55 14.73,58.55 14.97,58.78 | 14.97,58.78 S10.6 | 14.97,58.78 15.89,58.78 v16,58.67 17.02,59.69 v21.84,59.69 | U1.13 41.43,39.65 42.42,40.64 v42.42,41.66
  Bottom 0.254: v16,58.67 16,61.21 14.48,62.74 v11.68,62.74 | v42.42,41.66 36.58,47.5 36.58,57.66 34.54,59.69 v21.84,59.69
EN1  (via drill 0.25)
  Top 0.254: S11.12 13.47,48.12 | 13.47,48.12 13.34,48.26 13.08,48.26 12.97,48.15 12.97,48.01 | 12.97,48.01 S11.13 | S11.5 14.47,43.31 14.61,43.18 14.86,43.18 14.97,43.29 | 14.97,43.29 S11.6 | R10.1 11.48,51.22 D3.A | R10.1 13.47,50.72 13.47,48.12 | R10.1 17.87,51.22 18.8,50.29 18.8,48.77 v23.37,44.2 21.59,42.42 21.59,38.35 22.35,37.59 v25.91,37.59 | 14.97,43.29 15.86,43.29 v16,43.43 | v12.19,48.01 12.97,48.01 | U1.2 32.29,39.65 29.21,36.58 v27.94,36.58
  Bottom 0.254: S9.1 34.54,55.88 34.54,57.15 33.78,57.91 29.72,57.91 23.37,51.56 v23.37,44.2 | v16,43.43 16,46.23 14.48,47.75 12.45,47.75 v12.19,48.01 | v27.94,36.58 26.92,37.59 v25.91,37.59
EN2  (via drill 0.25)
  Top 0.254: S12.5 14.47,28.2 14.61,28.07 14.73,28.07 | 14.73,28.07 14.97,28.3 S12.6 | R11.1 11.48,35.98 D4.A | R11.1 13.47,35.48 S12.12 13.47,32.76 13.34,32.89 13.08,32.89 12.97,32.78 S12.13 12.92,32.26 v11.94,32.26 | 14.73,28.07 15.11,28.07 v15.49,27.69 | U1.3 32.4,39 29.21,35.81 v22.61,35.81 14.14,35.81 R11.1
  Bottom 0.254: S9.2 35.56,54.36 35.56,57.15 34.04,58.67 29.46,58.67 22.61,51.82 v22.61,35.81 | v11.94,32.26 14.22,32.26 15.49,30.99 v15.49,27.69
EN3  (via drill 0.25)
  Top 0.254: S13.5 14.47,12.96 14.61,12.83 14.73,12.83 | 14.73,12.83 14.97,13.06 S13.6 | R12.1 14.06,20.83 20.83,20.83 v21.84,19.81 | R12.1 11.48,20.74 D5.A | R12.1 13.47,20.24 S13.12 13.47,17.52 13.34,17.65 13.08,17.65 12.97,17.54 S13.13 12.92,17.02 v11.68,17.02 | 14.73,12.83 15.37,12.83 v15.49,12.7 | U1.4 32.51,38.35 29.21,35.05 v21.84,35.05
  Bottom 0.254: S9.3 34.53,51.54 36.07,53.09 36.07,57.4 34.29,59.18 29.21,59.18 21.84,51.82 v21.84,35.05 v21.84,19.81 | v15.49,12.7 15.49,15.75 14.22,17.02 v11.68,17.02
EN4  (via drill 0.25)
  Top 0.254: S14.6 49.04,17.54 49.15,17.65 49.28,17.65 | 49.28,17.65 49.4,17.65 49.54,17.52 S14.5 | S14.12 50.54,12.96 50.67,12.83 50.93,12.83 | 50.93,12.83 51.04,12.94 S14.13 | 50.93,12.83 52.2,12.83 v52.58,13.21 53.59,14.22 D6.A | 49.28,17.65 49.15,17.53 v48.26,17.53 v42.67,17.53 | v49.02,20.07 49.19,20.23 R13.1 | v36.58,36.58 35.45,37.7 U1.5
  Bottom 0.254: v52.58,13.21 52.58,14.99 50.04,17.53 v48.26,17.53 48.26,19.3 v49.02,20.07 | S9.4 42.67,40.13 42.67,32.77 | 42.67,32.77 v42.67,17.53 | 42.67,32.77 38.86,36.58 v36.58,36.58
EN5  (via drill 0.25)
  Top 0.254: S15.12 50.54,28.2 50.67,28.07 50.8,28.07 | 50.8,28.07 51.04,28.3 S15.13 | S15.6 49.04,32.78 | 49.04,32.78 49.15,32.89 49.4,32.89 49.54,32.76 S15.5 | 49.04,32.78 49.02,32.77 v48.01,32.77 43.94,32.77 v41.66,35.05 | v49.02,35.31 49.19,35.47 R14.1 | 50.8,28.07 51.69,28.07 v51.82,28.19 | v53.59,32 D7.A | v41.66,37.08 41.63,37.05 U1.9
  Bottom 0.254: v49.02,35.31 48.01,34.29 v48.01,32.77 50.29,32.77 51.82,31.24 v51.82,28.19 52.32,28.19 53.59,29.46 v53.59,32 | S9.5 30.21,50.82 41.66,39.37 v41.66,37.08 v41.66,35.05
EN6  (via drill 0.25)
  Top 0.254: S16.5 49.54,48 49.4,48.13 49.15,48.13 49.04,48.02 | 49.04,48.02 S16.6 | S16.12 50.54,43.44 50.67,43.31 50.8,43.31 | 50.8,43.31 51.04,43.55 S16.13 | 50.8,43.31 51.94,43.31 v51.82,43.18 | 49.04,48.02 49.02,48.01 v48.26,48.01 45.72,48.01 40.13,42.42 v37.34,42.42 | v49.02,50.55 49.19,50.71 R15.1 | v53.59,47.24 D8.A | v38.35,37.59 38.5,37.7 U1.10
  Bottom 0.254: S9.6 28.45,52.32 28.45,51.31 v37.34,42.42 38.35,41.4 v38.35,37.59 | v49.02,50.55 48.26,49.78 v48.26,48.01 50.04,48.01 51.82,46.23 v51.82,43.18 53.59,44.96 v53.59,47.24
EN7  (via drill 0.25)
  Top 0.254: S17.5 49.54,63.24 49.4,63.37 49.15,63.37 49.04,63.26 | 49.04,63.26 S17.6 | S17.12 50.54,58.55 50.67,58.42 50.8,58.42 | 50.8,58.42 51.04,58.66 S17.13 | v51.82,58.42 50.8,58.42 | v48.51,63.75 48.55,63.75 49.04,63.26 | v49.28,66.04 49.7,66.46 R16.1 | v34.8,43.69 35.81,43.69 48.01,55.88 49.28,55.88 50.8,57.4 50.8,58.42 | v53.59,62.48 D9.A | v37.59,38.35 U1.11
  Bottom 0.254: v49.28,66.04 48.51,65.28 v48.51,63.75 48.9,63.37 49.4,63.37 51.82,60.96 v51.82,58.42 53.59,60.2 v53.59,62.48 | S9.7 29.48,55.14 27.94,53.59 27.94,50.55 v34.8,43.69 37.59,40.89 v37.59,38.35
GND  (via drill 0.25)
  Top 0.254: S1.1 8.42,5.6 | 8.42,5.6 S1.2 | S2.2 14.51,5.56 | 14.51,5.56 S2.1 | S3.2 20.61,5.56 | 20.61,5.56 S3.1 | S4.2 S4.1 | S5.2 S5.1 | S6.2 S6.1 | S7.2 S7.1 | S8.2 S8.1 | 8.42,5.6 8.43,5.59 | 14.51,5.56 14.54,5.59 | 20.61,5.56 20.64,5.59
  other vias: 11.43,38.1 10.41,23.37 2.29,20.83 2.29,40.13 10.67,5.59 16.76,5.59 22.86,5.59 23.62,60.96 10.41,55.12 5.59,55.37 5.33,40.13 11.18,40.64 22.86,29.21 24.13,43.18 26.92,40.13 29.72,42.16 47.5,47.24 47.5,52.32 52.07,67.31 41.66,45.97 41.91,61.72 41.91,60.2 51.05,23.88 58.67,23.62 62.74,9.65 28.96,5.59 35.05,5.59 41.15,5.59 47.24,5.59 53.34,5.59 47.24,16.89 17.78,15.24 9.91,29.46 3.05,25.65 6.1,23.62 54.36,13.21 16.26,42.42 33.02,41.4
  pour Top (isolate 0.406): -1.27,-5.08 66.8,-5.33 66.29,80.52 -1.27,80.01
  pour Bottom: -1.27,80.01 66.8,79.76 65.79,-4.57 -1.27,-5.08
N$1
  Top 0.406: C1.1 25.41,38.47 U2.4
N$2
  Top 0.254: R2.1 8.66,65.39 D2.C
N$3
  Top 0.356: R1.2 12.42,71.77 D1.A
N$5
  Top 0.254: R3.1 8.66,48.4 D3.C
N$6
  Top 0.254: D4.C 10.39,33.19 R4.1
N$7
  Top 0.254: R5.1 8.66,17.92 D5.C
N$8
  Top 0.254: D6.C 55.34,19.67 R6.1
N$9
  Top 0.254: D7.C 53.62,34.89 R7.1
N$10
  Top 0.254: D8.C 53.62,50.13 R8.1
N$11
  Top 0.254: D9.C 55.34,65.39 R9.1
N$15
  Top 0.254: U1.1 37.17,40.3 38.47,39 U1.12
SWDCLK  (via drill 0.25)
  Top 0.254: S10.4 13.97,58.17 14.99,57.15 v19.81,57.15 | S11.4 13.97,42.93 15.49,41.4 v19.81,41.4 | S12.4 13.97,27.94 14.99,26.92 v19.81,26.92 | S13.4 13.97,12.7 14.73,11.94 16,11.94 19.81,15.75 v19.81,18.54 | S17.4 50.04,63.75 49.28,64.52 v44.45,64.52 | S16.4 50.04,48.26 49.53,48.77 v44.45,48.77 | S15.4 50.04,33.02 49.53,33.53 45.47,33.53 v44.45,34.54 | S14.4 50.04,17.78 49.53,18.29 v44.45,18.29
  Top 0.406: J1.9 32,71.75 32,70.1 33.78,68.33 v41.66,68.33
  Bottom 0.254: J15.4 51.56,72.39 49.02,72.39 44.96,68.33 v41.66,68.33
  Bottom 0.406: v19.81,18.54 v19.81,26.92 v19.81,41.4 v19.81,57.15 19.81,60.96 27.94,69.09 30.99,69.09 32,70.1 32,71.75 J1.9 | v41.66,68.33 44.45,65.53 v44.45,64.52 v44.45,48.77 v44.45,34.54 v44.45,18.29
SWDCLK0  (via drill 0.25)
  Top 0.254: S10.3 13.47,58.17 v13.21,57.91
  Bottom 0.254: v13.21,57.91 8.13,57.91 J2.4
SWDCLK1  (via drill 0.25)
  Top 0.254: S11.3 13.47,42.93 v12.95,42.42
  Bottom 0.254: v12.95,42.42 8.38,42.42 J3.4
SWDCLK2  (via drill 0.25)
  Top 0.254: S12.3 13.47,27.44 v12.95,26.92
  Bottom 0.254: v12.95,26.92 8.64,26.92 J4.4
SWDCLK3  (via drill 0.25)
  Top 0.254: S13.3 13.47,12.2 v12.95,11.68
  Bottom 0.254: v12.95,11.68 8.64,11.68 J5.4
SWDCLK4  (via drill 0.25)
  Top 0.254: S14.3 50.54,18.53 v50.55,18.54
  Bottom 0.254: J6.4 55.37,18.8 50.8,18.8 v50.55,18.54
SWDCLK5  (via drill 0.25)
  Top 0.254: S15.3 50.54,33.77 v50.55,33.78
  Bottom 0.254: J7.4 55.37,34.04 50.8,34.04 v50.55,33.78
SWDCLK6  (via drill 0.25)
  Top 0.254: S16.3 50.54,48.76 v50.29,49.02
  Bottom 0.254: J8.4 55.12,49.53 50.8,49.53 v50.29,49.02
SWDCLK7  (via drill 0.25)
  Top 0.254: S17.3 50.54,63.75 v51.05,64.26
  Bottom 0.254: v51.05,64.26 55.63,64.26 J9.4
SWDIO  (via drill 0.25)
  Top 0.254: v20.83,56.39 12.7,56.39 11.18,57.91 11.18,59.14 S10.1 | S11.1 11.68,44.41 11.68,42.42 13.46,40.64 v20.83,40.64 | S12.1 11.68,29.17 11.68,26.92 12.45,26.16 v20.83,26.16 | S13.1 11.68,13.93 11.68,11.94 12.7,10.92 15.75,10.92 20.83,16 v20.83,18.03 | S17.1 52.32,62.27 52.32,64.26 51.31,65.28 43.18,65.28 v42.93,65.53 | S14.1 52.07,16.3 52.07,18.29 51.05,19.3 v43.43,19.3 | v43.43,35.31 44.96,35.31 45.72,34.54 51.31,34.54 52.07,33.78 52.07,31.54 S15.1 | J15.2 49.53,74.42 37.21,74.42 J1.7 | S16.1 52.07,46.78 52.07,48.77 51.05,49.78 44.2,49.78 v43.43,49.02 | S19.2 v43.43,24.89
  Bottom 0.406: v20.83,18.03 v20.83,26.16 v20.83,40.64 v20.83,56.39 20.83,60.96 28.19,68.33 32.77,68.33 34.54,70.1 | 34.54,70.1 34.54,71.75 J1.7 | 34.54,70.1 36.32,68.33 40.13,68.33 v42.93,65.53 43.43,65.02 v43.43,49.02 v43.43,35.31 v43.43,24.89 v43.43,19.3
SWDIO0  (via drill 0.25)
  Top 0.254: S10.2 12.45,58.71 v12.19,58.67
  Bottom 0.254: v12.19,58.67 9.91,58.67 J2.2
SWDIO1  (via drill 0.25)
  Top 0.254: S11.2 12.45,43.47 v12.45,43.18
  Bottom 0.254: v12.45,43.18 10.16,43.18 J3.2
SWDIO2  (via drill 0.25)
  Top 0.254: S12.2 12.45,28.23 v12.45,27.69
  Bottom 0.254: v12.45,27.69 10.41,27.69 J4.2
SWDIO3  (via drill 0.25)
  Top 0.254: S13.2 12.45,12.99 v12.45,12.45
  Bottom 0.254: v12.45,12.45 10.41,12.45 J5.2
SWDIO4  (via drill 0.25)
  Top 0.254: S14.2 51.05,17.74 v51.31,18.03
  Bottom 0.254: v51.31,18.03 53.59,18.03 J6.2
SWDIO5  (via drill 0.25)
  Top 0.254: S15.2 51.04,33 v51.31,33.27
  Bottom 0.254: J7.2 53.59,33.27 v51.31,33.27
SWDIO6  (via drill 0.25)
  Top 0.254: S16.2 51.05,48.22 v51.31,48.51
  Bottom 0.254: J8.2 53.59,48.51 v51.31,48.51
SWDIO7  (via drill 0.25)
  Top 0.254: S17.2 51.56,63.21 v51.56,63.5
  Bottom 0.254: v51.56,63.5 53.85,63.5 J9.2
SWO  (via drill 0.25)
  Top 0.254: S10.8 15.71,61.72 v18.8,61.72 | S12.8 15.71,31.24 v18.8,31.24 | S13.8 15.71,16 17.27,16 18.8,17.53 v18.8,19.05 | S17.8 v45.48,60.21 v45.47,60.2 | S16.8 v45.48,44.97 v45.47,44.96 | S15.8 v45.48,29.73 v45.47,29.72 | S14.8 47.49,14.49 v45.47,16.51 | v18.8,45.72 16.45,45.72 S11.8
  Top 0.406: J1.13 26.92,71.75 26.92,69.09 28.7,67.31 v44.2,67.31
  Bottom 0.254: J15.6 54.1,72.39 52.32,72.39 51.56,71.63 51.56,70.36 51.05,69.85 48.51,69.85 45.97,67.31 v44.2,67.31
  Bottom 0.406: v18.8,19.05 v18.8,31.24 v18.8,45.72 v18.8,61.72 19.56,61.72 26.92,69.09 26.92,71.75 J1.13 | v44.2,67.31 45.47,66.04 v45.47,60.2 v45.47,44.96 v45.47,29.72 v45.47,16.51
SWO0  (via drill 0.25)
  Top 0.254: S10.9 15.19,62.69 v15.88,63.37
  Bottom 0.254: v15.88,63.37 10.03,63.37 8.64,64.77 4.57,64.77 3.81,64.01 3.81,59.69 J2.6
SWO1  (via drill 0.25)
  Top 0.254: S11.9 15.19,47.45 v16,48.26
  Bottom 0.254: J3.6 3.81,44.45 3.81,49.02 4.32,49.53 12.45,49.53 13.72,48.26 v16,48.26
SWO2  (via drill 0.25)
  Top 0.254: S12.9 14.97,32.5 v15.49,33.02
  Bottom 0.254: v15.49,33.02 11.43,33.02 10.16,34.29 4.57,34.29 3.81,33.53 3.81,29.72 5.08,28.45 J4.6
SWO3  (via drill 0.25)
  Top 0.254: S13.9 14.97,17.26 v15.49,17.78
  Bottom 0.254: v15.49,17.78 11.94,17.78 10.67,19.05 4.57,19.05 3.81,18.29 3.81,13.97 J5.6
SWO4  (via drill 0.25)
  Top 0.254: S14.9 47.8,13.52 v47.5,13.21
  Bottom 0.254: J6.6 60.2,16.51 60.2,11.94 59.44,11.18 50.55,11.18 48.51,13.21 v47.5,13.21
SWO5  (via drill 0.25)
  Top 0.254: S15.9 49.04,27.96 v48.77,27.69
  Bottom 0.254: v48.77,27.69 50.29,26.42 59.44,26.42 60.2,27.18 60.2,31.75 J7.6
SWO6  (via drill 0.25)
  Top 0.254: S16.9 49.04,43.2 v48.77,42.93
  Bottom 0.254: v48.77,42.93 50.04,41.66 59.69,41.66 60.2,42.16 60.2,46.99 J8.6
SWO7  (via drill 0.25)
  Top 0.254: S17.9 49.04,58.44 v48.77,58.17
  Bottom 0.254: J9.6 60.2,62.23 60.2,57.4 59.69,56.9 50.04,56.9 v48.77,58.17
VTREF  (via drill 0.25)
  Top 0.406: J1.1 48.39,73.03 J15.1 54.1,67.31 60.45,67.31 62.99,64.77 62.99,56.9 | 1.02,49.78 1.02,61.98 J2.1 5.59,66.55 v6.35,66.55 | 1.02,49.78 J3.1 | 1.02,49.78 1.02,34.54 | 1.02,34.54 J4.1 | 1.02,34.54 v1.02,24.89 1.02,19.3 J5.1 | J9.1 62.99,56.9 | 62.99,56.9 62.99,44.7 | 62.99,44.7 J8.1 | 62.99,44.7 62.99,29.46 | 62.99,29.46 J7.1 | 62.99,29.46 62.99,14.22 J6.1 | S18.2 v15.24,24.89
  Bottom 0.406: J1.1 41.53,74.93 14.73,74.93 v6.35,66.55 | v15.24,24.89 v1.02,24.89

### Text on the board
tPlace: D | IO | CLK | SWO | POWER | VCC | !RST | GND | Channel Select | 1 | 8 | 1 | 8 | 2 | 2016/11/01 | Brad Campbell | 7 | 3 | 6 | 4 | 2 | 5 | 7 | OCTOPROG | VREF | SWDIO | 3 | 6 | 3V3 | !RST | DEV | 4 | 5 | Reset Switches | 1 | 2 | 3 | 4 | 5 | 6 | 7 | 8